# Altium schematic sheet MAZ000163 - Diagrama físico.SchDoc: MAZ000163 - Diagrama físico
size A; ApprovedBy: Christian Ledwidth; CheckedBy: Nahuel Martinez; Author: Santiago Marti; CompanyName: Body Health; DrawnBy: Santiago Marti; Revision: A; SheetNumber: 2; SheetTotal: 2
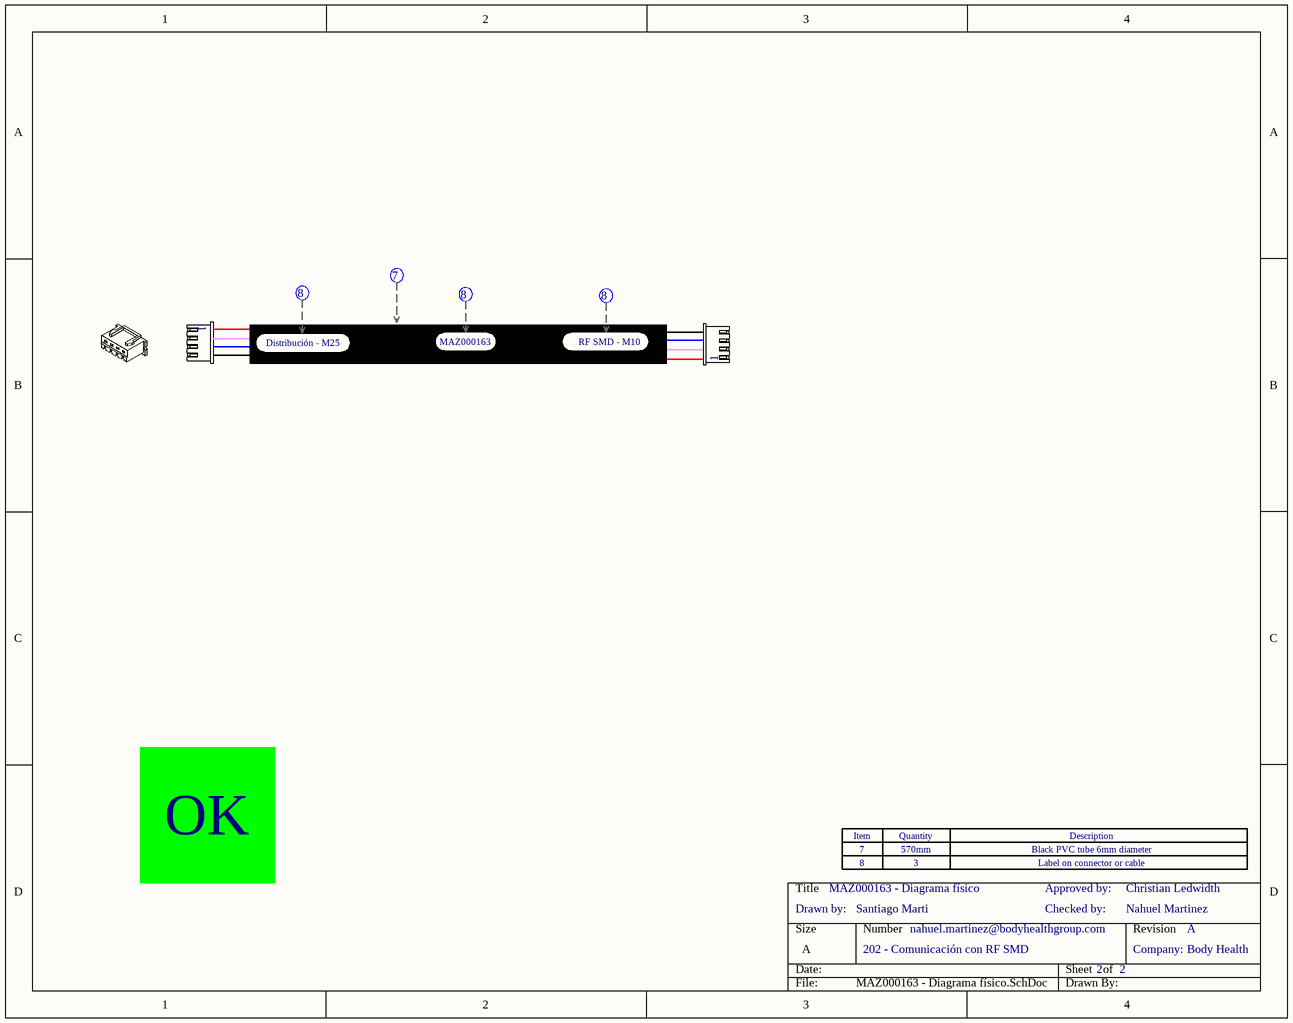
[diagram p0: MAZ000163 - Diagrama físico.SchDoc]

## Parts
Con1  XHP-4  (value not drawn)  (parts A,B of 4)
Con?  XHP-4  (value not drawn)  (part A of 4)
Eti1  Etiqueta  (value not drawn)
Eti2  Etiqueta  (value not drawn)
Eti3  Etiqueta  (value not drawn)
Ter1  Termocontraible  (value not drawn)
Zoc1  Zócalo_Header  (value not drawn)
Zoc10  Zócalo_Item  (value not drawn)
Zoc11  Zócalo_Item  (value not drawn)

## Notes on the sheet
- Distribución - M25
- (near Eti2) MAZ000163
- (near Eti3) RF SMD - M10
- OK
- Drawn by:
- 8
- 7
- 3
- 570mm
- Checked by:
- Approved by:
- Label on connector or cable
- Black PVC tube 6mm diameter
- 202 - Comunicación con RF SMD
- nahuel.martinez@bodyhealthgroup.com
- Company:
- (in symbol Zócalo_Header) Item; Quantity; Description

## Library data of the parts
Con1 Con? = XHP-4: CONN HOUSING 2.5MM 4POS; Fabricante: JST Sales America Inc.; Cod.DigiKey: 455-2267-ND; Cod.Fabricante: XHP-4; ComponentLink1Description: Manufacturer Link; ComponentLink1URL: http://www.jst-mfg.com/product/pdf/eng/eXH.pdf; DIGIKEYx50: 0.06220; CallOut: *; DIGIKEYx100: NO
Eti1-Eti3 = Etiqueta: CallOut: 8; Texto: *
Ter1 = Termocontraible: CallOut: 7; Largo: *; Diámetro: *
Zoc1 = Zócalo_Header: Header para el zócalo de referencias
Zoc10 Zoc11 = Zócalo_Item: Ítem para el zócalo de referencias; Desginator: *; Quantity: *; ItemDescription: *